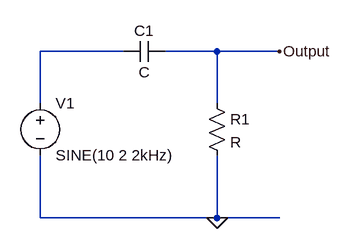
[diagram p0: schematic ac_coupling.asc]
ac_coupling.asc, the LTspice schematic file:
Version 4
SHEET 1 880 680
WIRE 304 176 176 176
WIRE 448 176 368 176
WIRE 544 176 448 176
WIRE 176 256 176 176
WIRE 448 256 448 176
WIRE 176 432 176 336
WIRE 448 432 448 336
WIRE 448 432 176 432
WIRE 544 432 448 432
FLAG 544 176 Output
FLAG 448 432 0
SYMBOL voltage 176 240 R0
SYMATTR InstName V1
SYMATTR Value SINE(10 2 2kHz)
SYMATTR Value2 AC 0 0
SYMBOL cap 368 160 R90
WINDOW 0 0 32 VBottom 2
WINDOW 3 32 32 VTop 2
SYMATTR InstName C1
SYMBOL res 432 240 R0
SYMATTR InstName R1

The netlist it stands for:
* ac_coupling.asc
V1 N001 0 SINE(10 2 2kHz) AC 0 0
C1 Output N001 C
R1 Output 0 R
.backanno
.end